# Altium schematic sheet 00 - REVISION.SchDoc
size 420 x 297 mm
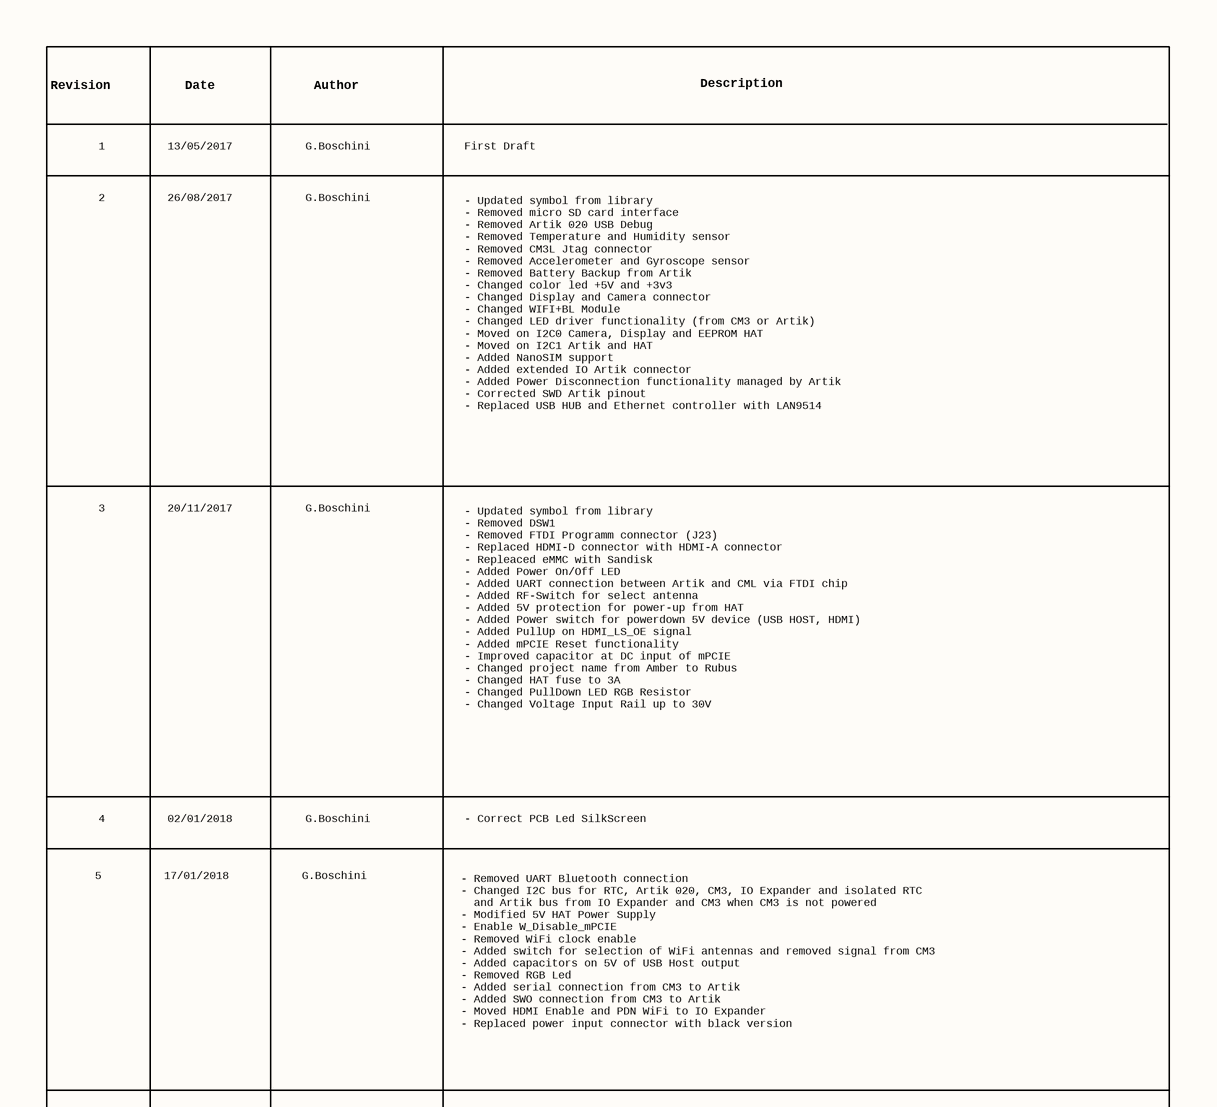
[diagram p0: 00 - REVISION.SchDoc, top left]
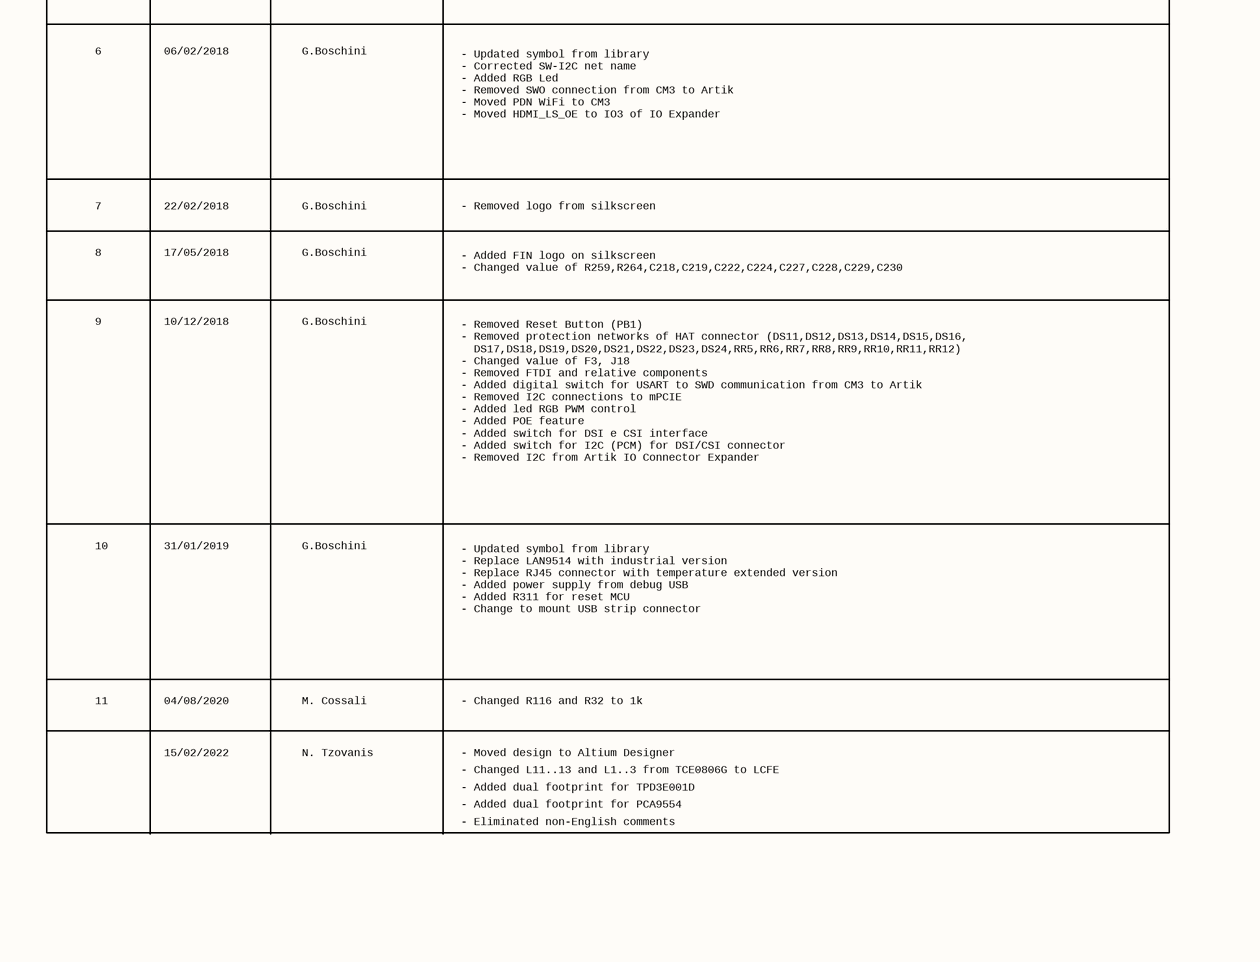
[diagram p1: 00 - REVISION.SchDoc, bottom left]
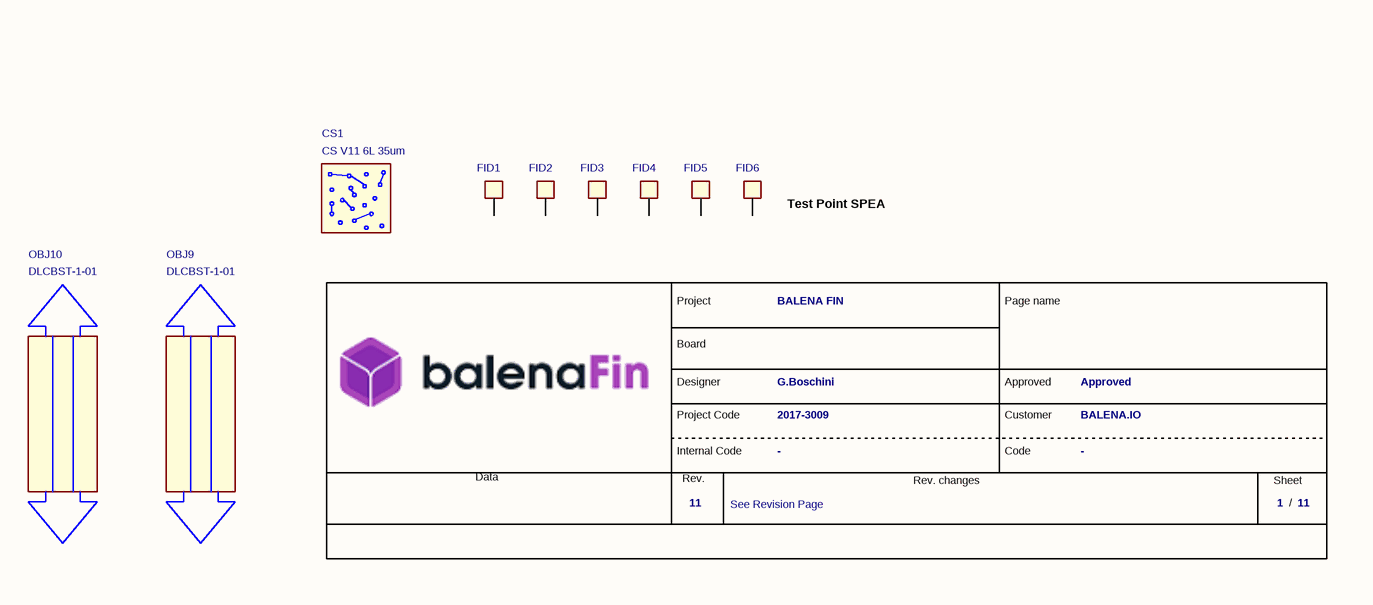
[diagram p2: 00 - REVISION.SchDoc, bottom right]

## Parts
*?  Revision: 11  FAE RD code: 2017-3009  DocumentoRev: See Revision Page  Page Number: 1  Nome Progetto: BALENA FIN  Customer name: BALENA.IO  Project manager: Approved  Project designer: G.Boschini  (hidden comment: MyFAEVuoto)  (graphical)
CS1  CS V11 6L 35um  (graphical)
FID1  TPS  [FIDUCIAL]  (value not drawn)  (no BOM)
FID2  TPS  [FIDUCIAL]  (value not drawn)  (no BOM)
FID3  TPS  [FIDUCIAL]  (value not drawn)  (no BOM)
FID4  TPS  [FIDUCIAL]  (value not drawn)  (no BOM)
FID5  TPS  [FIDUCIAL]  (value not drawn)  (no BOM)
FID6  TPS  [FIDUCIAL]  (value not drawn)  (no BOM)
OBJ9  DLCBST-1-01  (mechanical)
OBJ10  DLCBST-1-01  (mechanical)

## Nets

Not connected (* = marked no-connect by the designer): FID1 1(TP); FID2 1(TP); FID3 1(TP); FID4 1(TP); FID5 1(TP); FID6 1(TP)

## Notes on the sheet
- Revision
- Date
- Author
- Description
- 1
- 2
- 13/05/2017
- 26/08/2017
- G.Boschini
- First Draft
- - Updated symbol from library
  - Removed micro SD card interface
  - Removed Artik 020 USB Debug
  - Removed Temperature and Humidity sensor
  - Removed CM3L Jtag connector
  - Removed Accelerometer and Gyroscope sensor
  - Removed Battery Backup from Artik
  - Changed color led +5V and +3v3
  - Changed Display and Camera connector
  - Changed WIFI+BL Module
  - Changed LED driver functionality (from CM3 or Artik)
  - Moved on I2C0 Camera, Display and EEPROM HAT
  - Moved on I2C1 Artik and HAT
  - Added NanoSIM support
  - Added extended IO Artik connector
  - Added Power Disconnection functionality managed by Artik
  - Corrected SWD Artik pinout
  - Replaced USB HUB and Ethernet controller with LAN9514
- 3
- 20/11/2017
- 4
- 02/01/2018
- - Updated symbol from library
  - Removed DSW1
  - Removed FTDI Programm connector (J23)
  - Replaced HDMI-D connector with HDMI-A connector
  - Repleaced eMMC with Sandisk
  - Added Power On/Off LED
  - Added UART connection between Artik and CML via FTDI chip
  - Added RF-Switch for select antenna
  - Added 5V protection for power-up from HAT
  - Added Power switch for powerdown 5V device (USB HOST, HDMI)
  - Added PullUp on HDMI_LS_OE signal
  - Added mPCIE Reset functionality
  - Improved capacitor at DC input of mPCIE
  - Changed project name from Amber to Rubus
  - Changed HAT fuse to 3A
  - Changed PullDown LED RGB Resistor
  - Changed Voltage Input Rail up to 30V
- - Correct PCB Led SilkScreen
- 5
- 17/01/2018
- - Removed UART Bluetooth connection
  - Changed I2C bus for RTC, Artik 020, CM3, IO Expander and isolated RTC
  and Artik bus from IO Expander and CM3 when CM3 is not powered
  - Modified 5V HAT Power Supply
  - Enable W_Disable_mPCIE
  - Removed WiFi clock enable
  - Added switch for selection of WiFi antennas and removed signal from CM3
  - Added capacitors on 5V of USB Host output
  - Removed RGB Led
  - Added serial connection from CM3 to Artik
  - Added SWO connection from CM3 to Artik
  - Moved HDMI Enable and PDN WiFi to IO Expander
  - Replaced power input connector with black version
- 6
- 06/02/2018
- - Updated symbol from library
  - Corrected SW-I2C net name
  - Added RGB Led
  - Removed SWO connection from CM3 to Artik
  - Moved PDN WiFi to CM3
  - Moved HDMI_LS_OE to IO3 of IO Expander
- 7
- 8
- 22/02/2018
- 17/05/2018
- - Removed logo from silkscreen
- - Added FIN logo on silkscreen
  - Changed value of R259,R264,C218,C219,C222,C224,C227,C228,C229,C230
- 9
- 10/12/2018
- - Removed Reset Button (PB1)
  - Removed protection networks of HAT connector (DS11,DS12,DS13,DS14,DS15,DS16,
  DS17,DS18,DS19,DS20,DS21,DS22,DS23,DS24,RR5,RR6,RR7,RR8,RR9,RR10,RR11,RR12)
  - Changed value of F3, J18
  - Removed FTDI and relative components
  - Added digital switch for USART to SWD communication from CM3 to Artik
  - Removed I2C connections to mPCIE
  - Added led RGB PWM control
  - Added POE feature
  - Added switch for DSI e CSI interface
  - Added switch for I2C (PCM) for DSI/CSI connector
  - Removed I2C from Artik IO Connector Expander
- 10
- 31/01/2019
- - Updated symbol from library
  - Replace LAN9514 with industrial version
  - Replace RJ45 connector with temperature extended version
  - Added power supply from debug USB
  - Added R311 for reset MCU
  - Change to mount USB strip connector
- (near FID6) Test Point SPEA
- 11
- 04/08/2020
- M. Cossali
- - Changed R116 and R32 to 1k
- 15/02/2022
- N. Tzovanis
- - Moved design to Altium Designer
- - Changed L11..13 and L1..3 from TCE0806G to LCFE
- - Added dual footprint for TPD3E001D
- - Added dual footprint for PCA9554
- - Eliminated non-English comments
- (in symbol MyFAEVuoto) Project; Page name; Board; Designer; Project Code; Customer; Internal Code; Code; Data; Rev.; Rev. changes; Sheet; /

## Library data of the parts
CS1 = PCB-CS: C.S. BALENAFIN V11 (90x90)mm ENIG 8L/SO(NERO)/SR sp=1.6mm Cu=35um; Famiglia: CIRCUITO STAMPATO; Caratteristiche: 20173009_BALENA-FIN_V11; Note: G.Boschini; Modello: BALENA; Price Distributor Cad: 0; Distributor: WE-ONLINE
FID1-FID6 = FIDUCIAL: MPN: Fiducial-No-BoM; Pkg Type: SMD; Mount: Yes
OBJ9 OBJ10 = SUPPORT PCB - DLCBST-1-01: Board Support Snap Lock / Snap Lock Nylon 0.063" (1.60mm) 1/16"; Note: Hole D=2.54mm; Pkg Type: THT; MPN: DLCBST-1-01; Mount: Yes
*? = MyFAEVuoto: Page Count: 11; Customer Code: -; Database: -